# EAGLE design Claw Machine Final (EAGLE 9.6.2)
AUTHOR: Yiu & Humpal; BOARD_NAME: Claw Machine; DOC_NUM: 0001; PROJECT_NAME: Chessbot; REVISION: 5
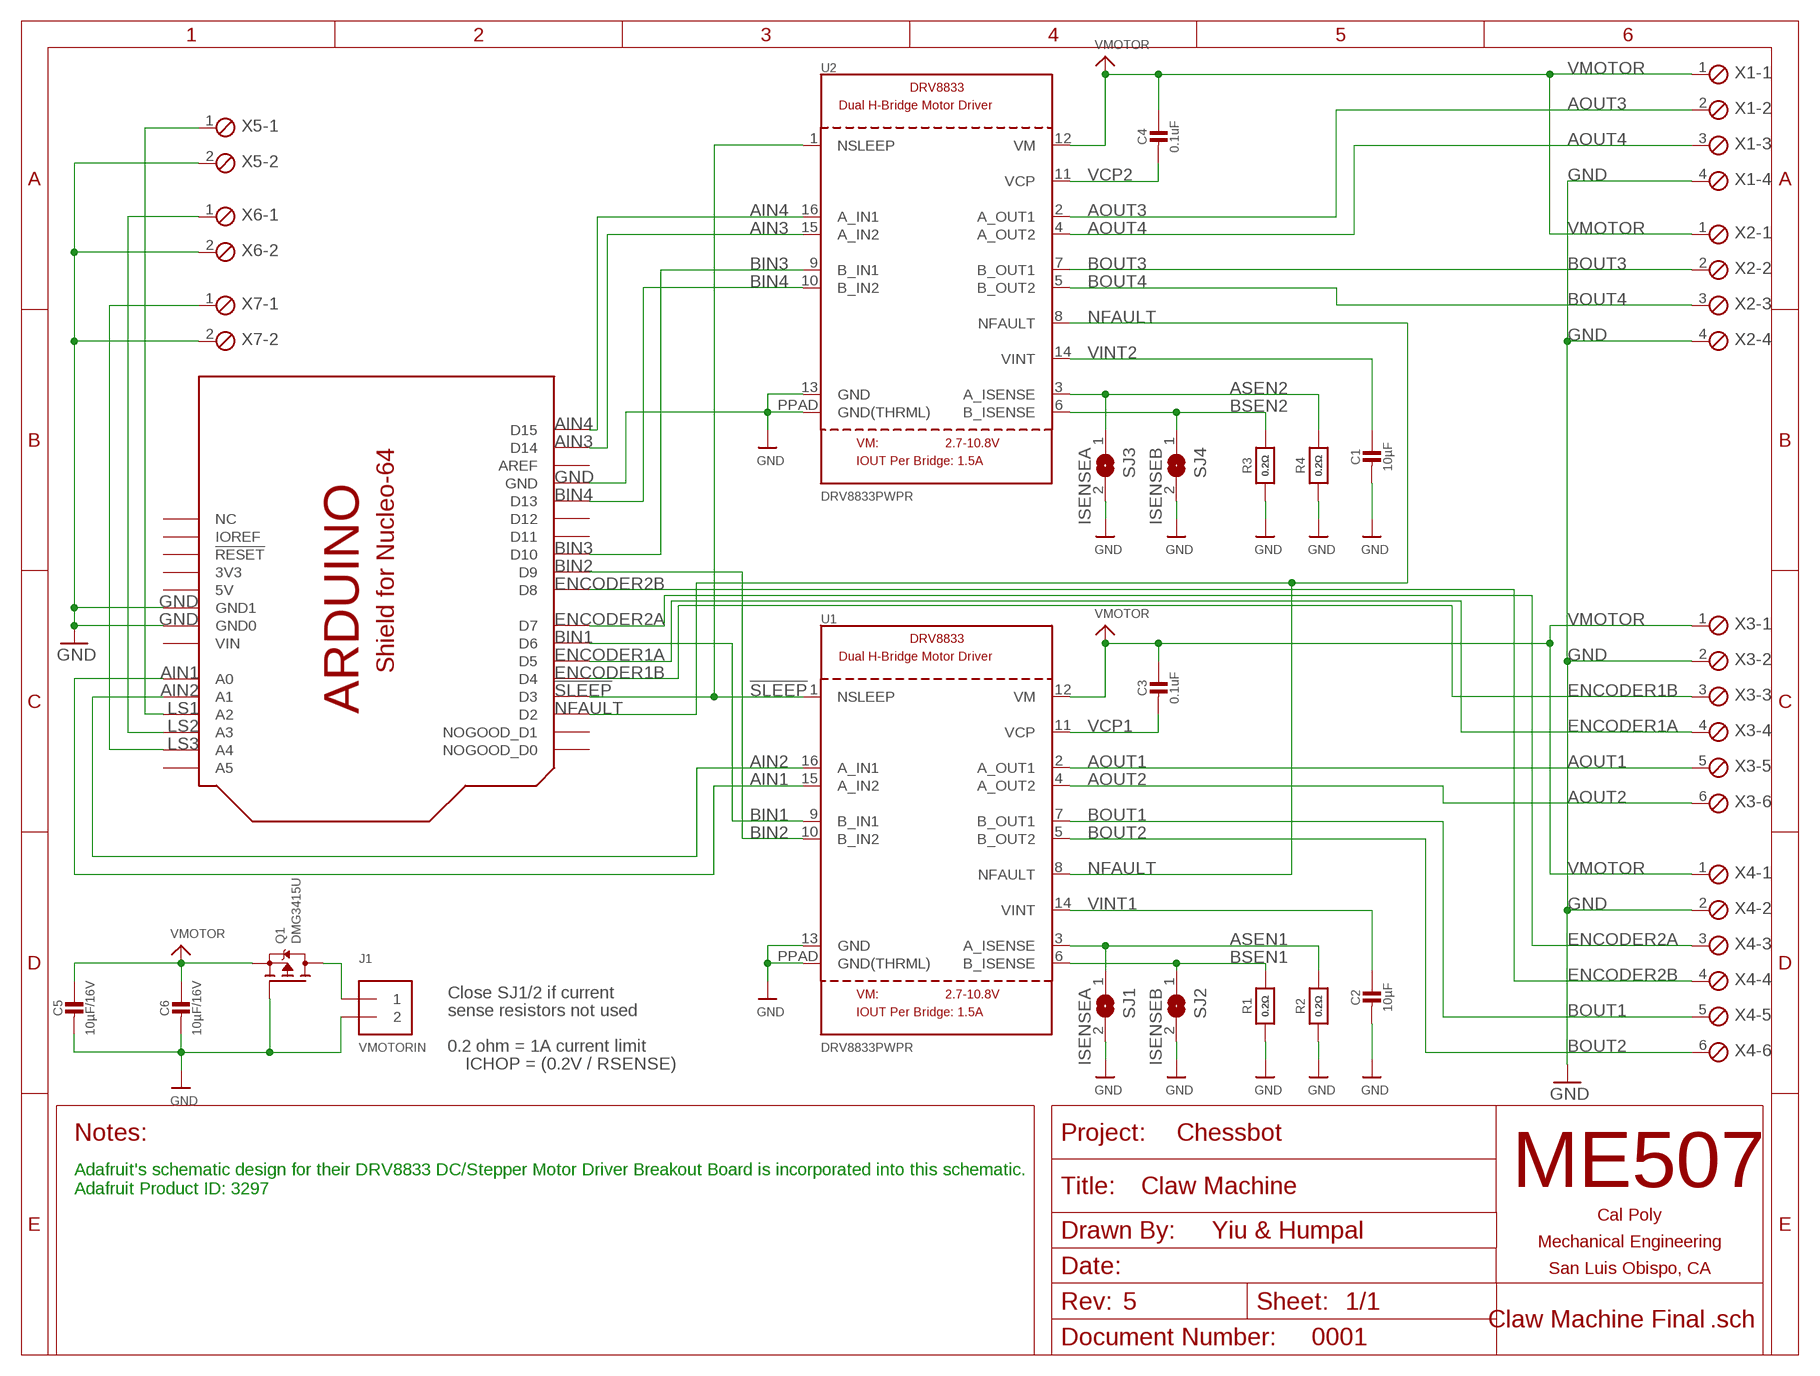
[diagram p0: schematic, sheet 1]

## Parts
C1  10µF  CAP_CERAMIC0805-NOOUTLINE  [0805-NO]
C2  10µF  CAP_CERAMIC0805-NOOUTLINE  [0805-NO]
C3  0.1uF  CAP_CERAMIC0805-NOOUTLINE  [0805-NO]
C4  0.1uF  CAP_CERAMIC0805-NOOUTLINE  [0805-NO]
C5  10µF/16V  CAP_CERAMIC0805-NOOUTLINE  [0805-NO]
C6  10µF/16V  CAP_CERAMIC0805-NOOUTLINE  [0805-NO]
J1  VMOTORIN  TERMBLOCK_1X2  [TERMBLOCK_1X2-3.5MM]
Q1  DMG3415U  MOSFET-PWIDE  [SOT23-WIDE]
R1  0.2Ω  RESISTOR_1206  [_1206]
R2  0.2Ω  RESISTOR_1206  [_1206]
R3  0.2Ω  RESISTOR_1206  [_1206]
R4  0.2Ω  RESISTOR_1206  [_1206]
SJ1  ISENSEA  SOLDERJUMPER  [SOLDERJUMPER_ARROW_NOPASTE]
SJ2  ISENSEB  SOLDERJUMPER  [SOLDERJUMPER_ARROW_NOPASTE]
SJ3  ISENSEA  SOLDERJUMPER  [SOLDERJUMPER_ARROW_NOPASTE]
SJ4  ISENSEB  SOLDERJUMPER  [SOLDERJUMPER_ARROW_NOPASTE]
U1  DRV8833PWPR  DRV8833  [HTSSOP16]
U2  DRV8833PWPR  DRV8833  [HTSSOP16]
U$1  SHIELD_FOR_NUCLE0_64_STANDARD  [SHIELD_FOR_NUCLEO_64_STD]
X1  SCREWTERM_4P_254  [4POL254]
X2  SCREWTERM_4P_254  [4POL254]
X3  SCREWTERM_6P_254  [6POL254]
X4  SCREWTERM_6P_254  [6POL254]
X5  SCREWTERM_2P_254  [2POL254]
X6  SCREWTERM_2P_254  [2POL254]
X7  SCREWTERM_2P_254  [2POL254]

## Nets
!SLEEP: U1.1(NSLEEP) U2.1(NSLEEP) U$1.D3
AIN1: U1.15(A_IN2) U$1.A0
AIN2: U1.16(A_IN1) U$1.A1
AIN3: U2.15(A_IN2) U$1.D14
AIN4: U2.16(A_IN1) U$1.D15
AOUT1: U1.2(A_OUT1) X3.5
AOUT2: U1.4(A_OUT2) X3.6
AOUT3: U2.2(A_OUT1) X1.2
AOUT4: U2.4(A_OUT2) X1.3
ASEN1: R2.2 SJ1.1 U1.3(A_ISENSE)
ASEN2: R4.2 SJ3.1 U2.3(A_ISENSE)
BIN1: U1.9(B_IN1) U$1.D6
BIN2: U1.10(B_IN2) U$1.D9
BIN3: U2.9(B_IN1) U$1.D10
BIN4: U2.10(B_IN2) U$1.D13
BOUT1: U1.7(B_OUT1) X4.5
BOUT2: U1.5(B_OUT2) X4.6
BOUT3: U2.7(B_OUT1) X2.2
BOUT4: U2.5(B_OUT2) X2.3
BSEN1: R1.2 SJ2.1 U1.6(B_ISENSE)
BSEN2: R3.2 SJ4.1 U2.6(B_ISENSE)
ENCODER1A: U$1.D5 X3.4
ENCODER1B: U$1.D4 X3.3
ENCODER2A: U$1.D7 X4.3
ENCODER2B: U$1.D8 X4.4
GND: C1.2 C2.2 C5.2 C6.2 J1.2 Q1.1(G) R1.1 R2.1 R3.1 R4.1 SJ1.2 SJ2.2 SJ3.2 SJ4.2 U1.13(GND) U1.PPAD(GND(THRML)) U2.13(GND) U2.PPAD(GND(THRML)) U$1.GND U$1.GND1(GND0) U$1.GND2(GND1) X1.4 X2.4 X3.2 X4.2 X5.2 X6.2 X7.2
LS1: U$1.A2 X5.1
LS2: U$1.A3 X6.1
LS3: U$1.A4 X7.1
NFAULT: U1.8(NFAULT) U2.8(NFAULT) U$1.D2
PWRIN: J1.1 Q1.3(D)
VCP1: C3.2 U1.11(VCP)
VCP2: C4.2 U2.11(VCP)
VINT1: C2.1 U1.14(VINT)
VINT2: C1.1 U2.14(VINT)
VMOTOR: C3.1 C4.1 C5.1 C6.1 Q1.2(S) U1.12(VM) U2.12(VM) X1.1 X2.1 X3.1 X4.1
Unconnected: U$1.A5 U$1.AREF U$1.D0(NOGOOD_D0) U$1.D1(NOGOOD_D1) U$1.D11 U$1.D12 U$1.IOREF U$1.NC U$1.NRST(!RESET)

## Notes on the sheet
- Close SJ1/2 if current
- sense resistors not used
- 0.2 ohm = 1A current limit
- ICHOP = (0.2V / RSENSE)
- Adafruit's schematic design for their DRV8833 DC/Stepper Motor Driver Breakout Board is incorporated into this schematic.
  Adafruit Product ID: 3297

## Power pins joined to a net without a drawn wire
3V3: U$1.3V(3V3)
5V: U$1.5V
VIN: U$1.VIN

## Library data of the parts
C1-C6 = microbuilder:CAP_CERAMIC: Ceramic Capacitors For new designs, use the packages preceded by an '_' character since they are more reliable: The following footprints should be used on most boards: _0402 - Standard footprint for regular board layouts _0603 - Standard footprint for regular board layouts _0805 - Standard footprint for regular board layouts _1206 - Standard footprint for regular board layouts For extremely tight-pitch boards where space is at a premium, the following 'micro-pitch' footprints can be used (smaller pads, no silkscreen outline, etc.): _0402MP - Micro-pitch footprint for very dense/compact boards _0603MP - Micro-pitch footprint for very dense/compact boards _0805MP - Micro-pitch footprint for very dense/compact boards _1206MP - Micro-pitch footprint for very dense/compact boards
J1 = microbuilder:TERMBLOCK_1X2: 3.5mm Terminal block http://www.ladyada.net/library/pcb/eaglelibrary.html
Q1 = microbuilder:MOSFET-P: P-Channel Mosfet LEGEND VDS: Voltage Drain-Source ID: Drain Current RDS(ON): Drain-Source On-State Resistance VGS(TH): Gate-Source Threshold Voltage CISS: Drain-Source Input Capacitance SOT-23 Name VDS ID RDS(ON) VGS(TH) CISS Order Number IRLML5103 30V 760mA 600 mOhm -- 75pF @ 25V Digikey: IRLML5103PBFCT-ND IRLML6401 12V 4.3A 50 mOhm 950mV @ 250µA 830pF @ 10V Digikey: IRLML6401PBFTR-ND NTR0202PL 20V 400mA 800 mOhm 2.3V @ 250uA 70pF @ 5V Digikey: NTR0202PLT1GOSTR-ND NTR4101PT1G 20V 1.8A 85 mOhm 1.2V @ 250uA 675pF @ 10V Digikey: NTR4101PT1GOSCT-ND DMP2004K 20V 600mA 900 mOhm 1V @ 250uA 175pF @ 16V Digikey: DMP2004KDICT-ND PMV65XP 20V 3.9A 76 mOhm 950mV @ 1mA 725pF @ 20V Digikey: 568-2358-2-ND TO-252 Name VDS ID RDS(ON) VGS(TH) CISS Order Number AOD417 30V 25A 34 mOhm 3V @ 250µA 920pF @ 15V Digikey: 785-1106-2-ND
R1-R4 = microbuilder:RESISTOR: Resistors For new designs, use the packages preceded by an '_' character since they are more reliable: The following footprints should be used on most boards: _0402 - Standard footprint for regular board layouts _0603 - Standard footprint for regular board layouts _0805 - Standard footprint for regular board layouts _1206 - Standard footprint for regular board layouts For extremely tight-pitch boards where space is at a premium, the following 'micro-pitch' footprints can be used (smaller pads, no silkscreen outline, etc.): _0402MP - Micro-pitch footprint for very dense/compact boards _0603MP - Micro-pitch footprint for very dense/compact boards _0805MP - Micro-pitch footprint for very dense/compact boards _1206MP - Micro-pitch footprint for very dense/compact boards
SJ1-SJ4 = microbuilder:SOLDERJUMPER: SMD Solder JUMPER Solder the two pads together to create a connection, or remove the solder to break it. REFLOW - Use this footprint for solder paste and reflow ovens. WAVE - Use this footprint for hand-soldering (larger pads). CLOSED - Has a trace between the two pads to ensure it is closed by default. The trace needs to be cut to disable the jumper, and can be closed again by creating a solder bridge between the two pads.; BOM: EXCLUDE
U1 U2 = microbuilder:DRV8833: DRV8833 Dual H-Bridge Motor Driver -- HTSSOP Package
U$1 = ME507:SHIELD_FOR_NUCLE0_64: Arduino Style Shield for Nucleo-64 This is a board outline with pin locations for an Arduino style shield which fits on top of an STM32 Nucleo-64. Pin names are generic except for Nucleo specific pins such as IOREF. There are two board sizes, the standard which matches the size of an Arduino Uno, and the short version which can be less expensive to produce if you don't need a lot of board area. The outline is on the DIMENSION layer. When making a new board, you must delete the lines which form the default board outline so that this package's outlines control the dimensions of the board. Pins D0 and D1 are connected to a communications port and are not available for general use, so they are labeled as NOGOOD on the symbol and footprints.
X1 X2 = ME507:SCREWTERM_4P: Screw Terminal Block This part is designed for a screw terminal connector. The 2.54mm (0.100 inch) foorprint can also be used for male or female pin headers such as those on most development boards. One can also solder wires directly into the holes, though this makes modifications or repairs to the system more inconvenient. Larger versions can carry more current.
X3 X4 = ME507:SCREWTERM_6P: Screw Terminal Block This part is designed for a screw terminal connector. The 2.54mm (0.100 inch) foorprint can also be used for male or female pin headers such as those on most development boards. One can also solder wires directly into the holes, though this makes modifications or repairs to the system more inconvenient. Larger versions can carry more current.
X5-X7 = ME507:SCREWTERM_2P: Screw Terminal Block This part is designed for a screw terminal connector. The 2.54mm (0.100 inch) foorprint can also be used for male or female pin headers such as those on most development boards. One can also solder wires directly into the holes, though this makes modifications or repairs to the system more inconvenient. Larger versions can carry more current.

## Board
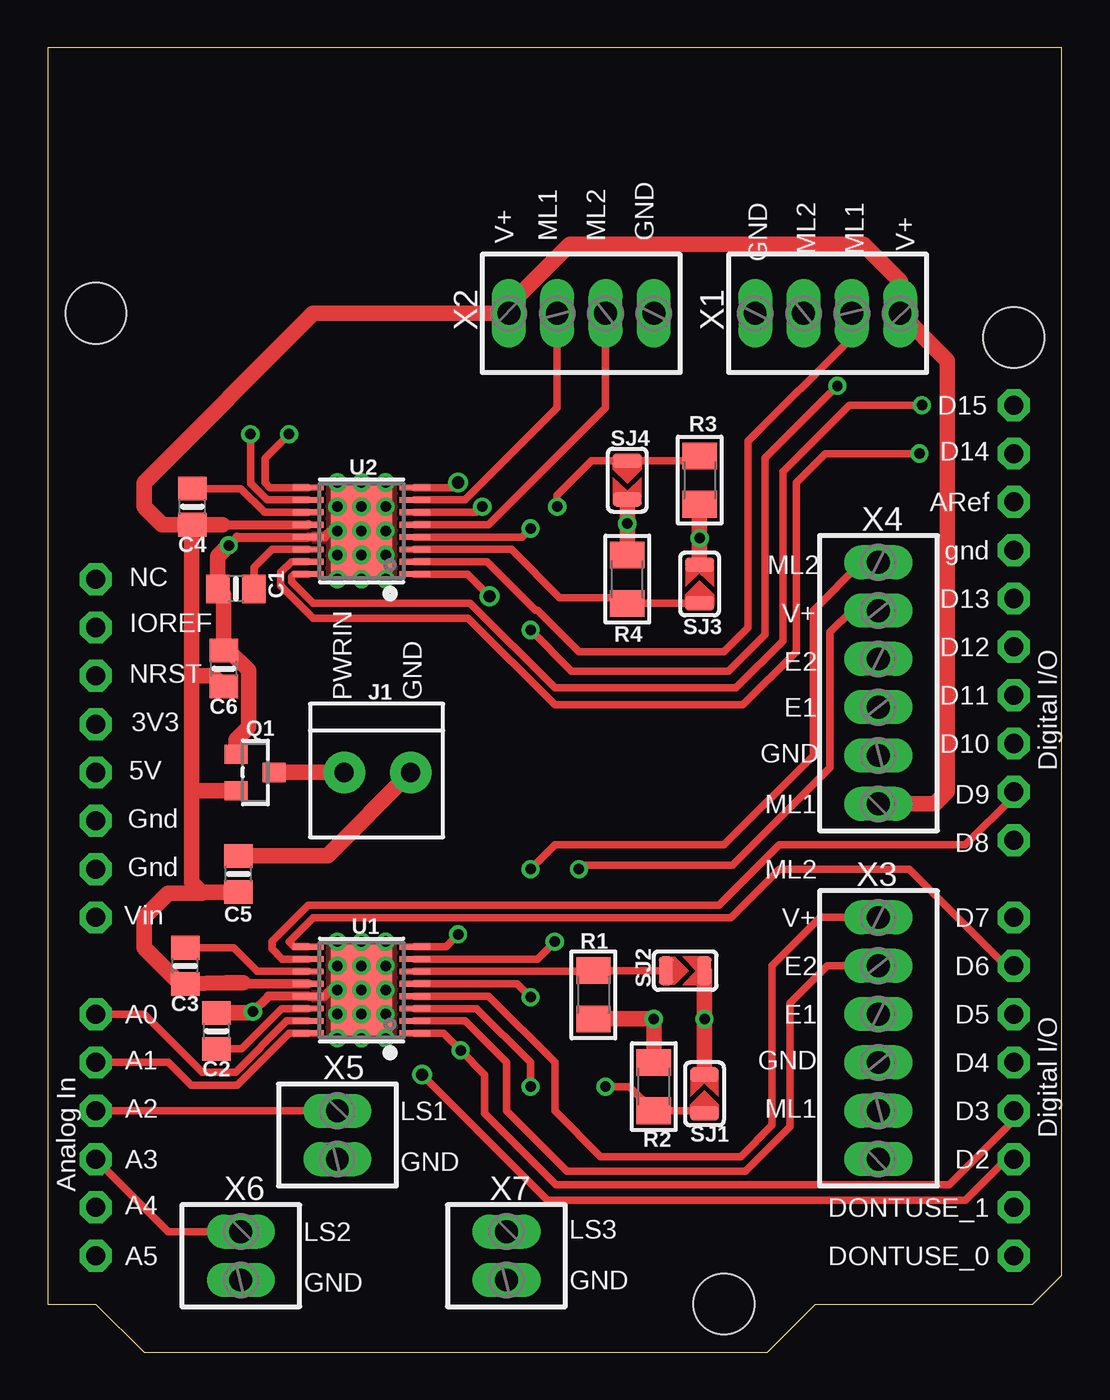
[diagram p1: board, top side]
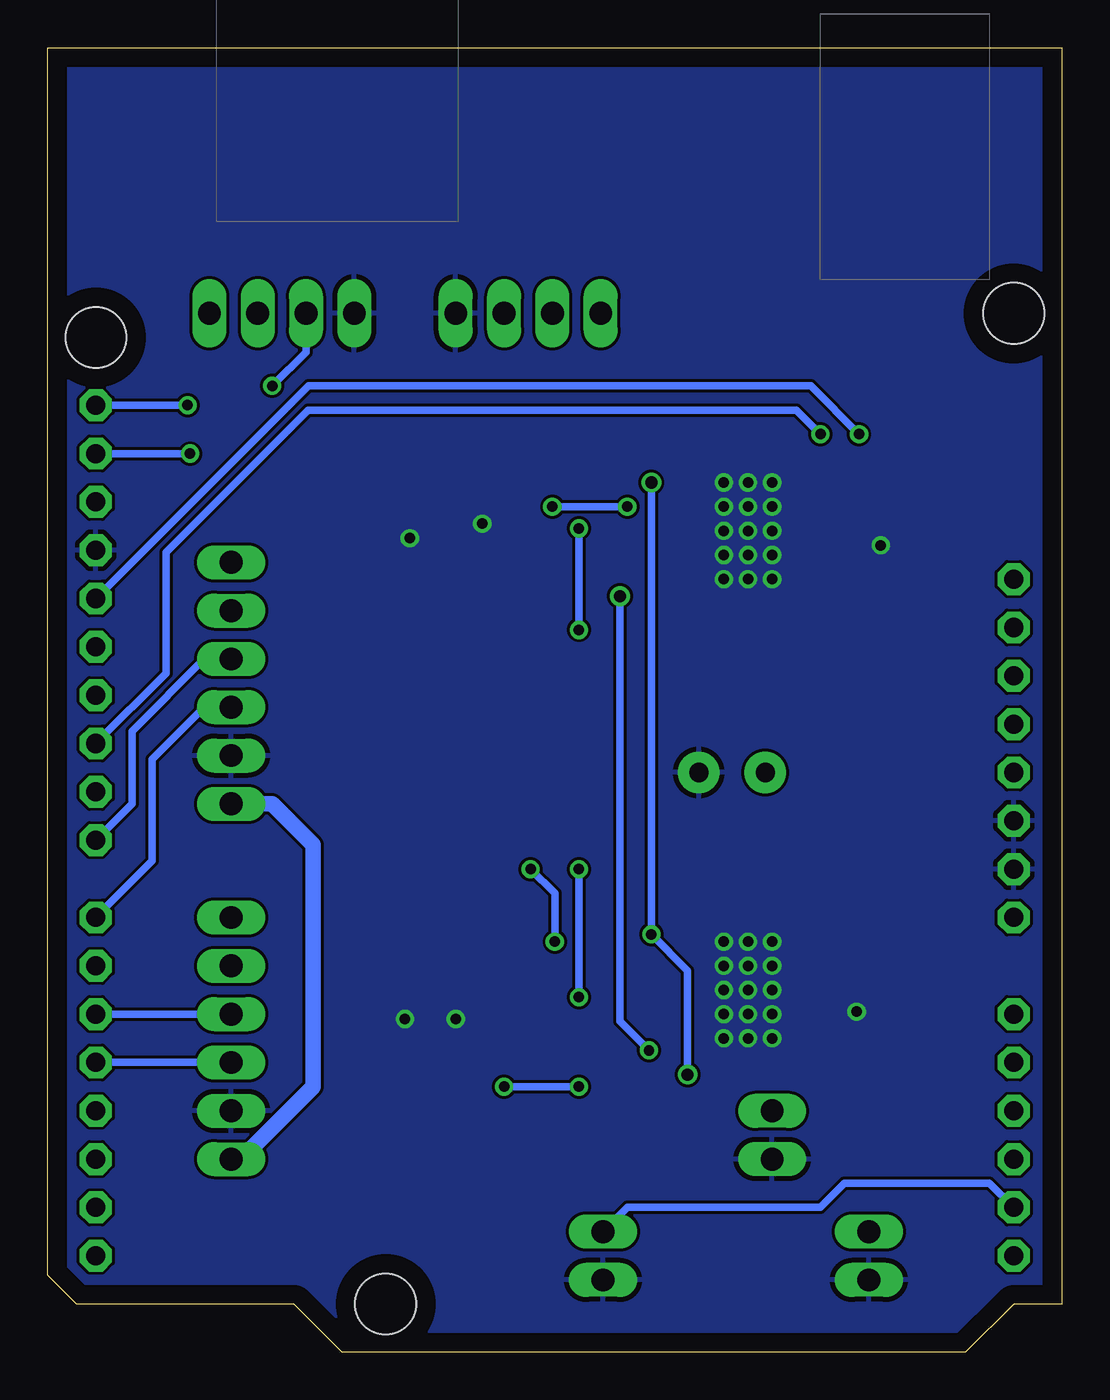
[diagram p2: board, bottom side, seen from below]

Size 53.34 x 68.58 mm. Coordinates in mm from the lower left corner, seen from the top.
Copper layers (1*16): Top 0.035mm / dielectric 1.5mm / Bottom 0.035mm
Design rules "default": minimum track width 6mil, minimum drill 0.35mm, track to track 6mil, track to pad 6mil, pad to pad 6mil, via to via 6mil, smd to smd 6mil, copper to edge 40mil, drill to drill 6mil, minimum pad ring 10mil, minimum via ring 8mil, stop-mask expansion 4mil, vias tented up to drill 0mil, thermal gap 10mil

### Footprints (pad centres in the part's own frame; a part is rotated, then mirrored left to right if it is on the bottom)
0805-NO = smd 1.24 x 1.5: 1 -0.95,0; 2 0.95,0
TERMBLOCK_1X2-3.5MM = drill 1 pad 2.184: 1 1.8,0; 2 -1.7,0
SOT23-WIDE = smd 1 x 1.2: 1 -0.95,-1; 2 0.95,-1; 3 0,1
_1206 = smd 1.4 x 1.8: 1 -1.27,0; 2 1.27,0
SOLDERJUMPER_ARROW_NOPASTE = smd 0.762 x 1.524: 1 -1.016,0; 2 1.016,0
HTSSOP16 = smd 0.3 x 1.6: 1 -2.275,-2.8; 2 -1.625,-2.8; 3 -0.975,-2.8; 4 -0.325,-2.8; 5 0.325,-2.8; 6 0.975,-2.8; 7 1.625,-2.8; 8 2.275,-2.8; 9 2.275,2.8; 10 1.625,2.8; 11 0.975,2.8; 12 0.325,2.8; 13 -0.325,2.8; 14 -0.975,2.8; 15 -1.625,2.8; 16 -2.275,2.8 | smd 4.8 x 3.2: PPAD 0,0
SHIELD_FOR_NUCLEO_64_STD = drill 1 pad 1.676 octagon: 3V 35.56,2.54; 5V 38.1,2.54; A0 50.8,2.54; A1 53.34,2.54; A2 55.88,2.54; A3 58.42,2.54; A4 60.96,2.54; A5 63.5,2.54; AREF 23.876,50.8; D0 63.5,50.8; D1 60.96,50.8; D2 58.42,50.8; D3 55.88,50.8; D4 53.34,50.8; D5 50.8,50.8; D6 48.26,50.8; D7 45.72,50.8; D8 41.656,50.8; D9 39.116,50.8; D10 36.576,50.8; D11 34.036,50.8; D12 31.496,50.8; D13 28.956,50.8; D14 21.336,50.8; D15 18.796,50.8; GND 26.416,50.8; GND1 43.18,2.54; GND2 40.64,2.54; IOREF 30.48,2.54; NC 27.94,2.54; NRST 33.02,2.54; VIN 45.72,2.54 | hole 3.2: 15.24,50.8; 66.04,35.56; 13.97,2.54
4POL254 = drill 1.2 long: 1 -3.81,0; 2 -1.27,0; 3 1.27,0; 4 3.81,0
6POL254 = drill 1.2 pad 1.778 long: 1 -6.35,0; 2 -3.81,0; 3 -1.27,0; 4 1.27,0; 5 3.81,0; 6 6.35,0
2POL254 = drill 1.2 long: 1 -1.27,0; 2 1.27,0

### Placement (x,y rotation side)
C1  9.91,40.13 180 top
C2  8.89,16.89 90 top
C3  7.24,20.32 90 top
C4  7.62,44.45 90 top
C5  10.03,25.15 90 top
C6  9.27,35.94 90 top
J1  17.4,30.48 180 top
Q1  10.92,30.48 270 top
R1  28.7,18.8 90 top
R2  31.88,13.97 270 top
R3  34.29,45.85 90 top
R4  30.48,40.64 270 top
SJ1  34.54,13.59 90 top
SJ2  33.53,20.07 0 top
SJ3  34.29,40.39 90 top
SJ4  30.48,45.85 270 top
U1  16.51,19.05 90 top
U2  16.51,43.18 90 top
U$1  0,68.58 270 top
X1  41.02,54.61 180 top
X2  28.07,54.61 0 top
X3  43.69,16.51 90 top
X4  43.69,35.18 90 top
X5  15.24,11.43 270 top
X6  10.16,5.08 270 top
X7  24.13,5.08 270 top

### Tracks (layer width: path | path; a pad name or v marks a point on that pad's centre or on a via)
!SLEEP  (via drill 0.55, 0.64)
  Top 0.406: v23.24,39.75 22.09,40.9 U2.1 | U1.1 20.82,16.77 v21.72,15.87 22.99,14.6 22.99,12.57 26.75,8.81 47.42,8.81 50.8,12.19 U$1.D3
  Bottom 0.406: v23.24,39.75 23.24,17.4 v21.72,15.87
AIN1
  Top 0.406: U$1.A0 5.08,17.78 8.13,14.73 9.88,14.73 12.57,17.42 U1.15
AIN2
  Top 0.406: U1.16 12.71,16.77 9.98,14.05 7.54,14.05 6.35,15.24 U$1.A1
AIN3  (via drill 0.55)
  Top 0.406: v45.85,47.24 40.89,47.24 39.37,45.72 39.37,36.83 36.58,34.04 26.67,34.04 22.11,38.59 13.96,38.59 12.27,40.28 12.27,41 12.82,41.55 U2.15
  Bottom 0.406: U$1.D14 v45.85,47.24
AIN4  (via drill 0.55)
  Top 0.406: U2.16 12.96,40.9 12.83,40.77 12.83,40.51 13.97,39.37 22.22,39.37 26.67,34.92 36.2,34.92 38.66,37.39 38.66,46.28 42.16,49.78 v45.97,49.78
  Bottom 0.406: U$1.D15 v45.97,49.78
AOUT1
  Top 0.406: U1.2 21.95,17.42 24.13,15.24 24.13,12.7 27.3,9.52 36.7,9.52 39.04,11.86 39.04,18.35 41.01,20.32 X3.5
AOUT2
  Top 0.406: U1.4 23.19,18.72 26.67,15.24 26.67,12.7 29.08,10.29 36.45,10.29 38.1,11.94 38.1,20.32 40.64,22.86 X3.6
AOUT3
  Top 0.406: U2.2 23.12,41.55 25.66,39.01 25.76,39.01 27.94,36.83 35.56,36.83 36.83,38.1 36.83,47.88 42.29,53.34 X1.2
AOUT4  (via drill 0.55)
  Top 0.406: U2.4 24.95,42.85 v25.4,43.31 | v25.4,37.97 27.56,35.81 35.81,35.81 37.72,37.72 37.72,46.99 v41.53,50.8
  Bottom 0.406: v25.4,43.31 v25.4,37.97 | v41.53,50.8 39.75,52.58 X1.3
ASEN1  (via drill 0.55)
  Top 0.406: U1.3 22.56,18.07 25.4,15.24 v25.4,13.97 | v29.34,13.97 30.61,13.97 R2.2 34.42,12.7 SJ1.1
  Bottom 0.406: v25.4,13.97 v29.34,13.97
ASEN2
  Top 0.406: U2.3 24.39,42.2 26.93,39.66 30.19,39.66 R4.2 SJ3.1
BIN1
  Top 0.406: U1.9 12.96,21.32 12.7,21.59 13.96,22.85 35.94,22.85 38.48,25.4 45.3,25.4 50.38,20.32 U$1.D6
BIN2
  Top 0.406: U1.10 12.34,20.67 11.81,21.21 11.81,21.62 13.69,23.49 35.31,23.49 38.48,26.67 48.26,26.67 50.8,29.21 U$1.D9
BIN3  (via drill 0.55)
  Top 0.406: U2.9 11.69,45.45 11.43,45.71 11.43,46.99 v12.7,48.26
  Bottom 0.406: U$1.D10 47.11,35.69 47.11,42.05 39.63,49.53 13.97,49.53 v12.7,48.26
BIN4  (via drill 0.55)
  Top 0.406: U2.10 11.54,44.8 10.67,45.68 v10.67,48.26
  Bottom 0.406: U$1.D13 39.62,50.8 13.21,50.8 v10.67,48.26
BOUT1  (via drill 0.55)
  Top 0.406: U1.7 25.76,20.67 v26.67,21.59 | X4.5 42.28,38.99 41.15,37.85 41.15,30.73 36.01,25.6 28.14,25.6 v27.94,25.4
  Bottom 0.406: v27.94,25.4 26.67,24.13 v26.67,21.59
BOUT2  (via drill 0.55)
  Top 0.406: U1.5 24.69,19.37 v25.4,18.67 | X4.6 42.8,41.53 40.26,38.99 40.26,31.37 35.56,26.67 26.67,26.67 v25.4,25.4
  Bottom 0.406: v25.4,25.4 v25.4,18.67
BOUT3
  Top 0.406: U2.7 21.95,44.8 26.8,49.66 X2.2
BOUT4
  Top 0.406: U2.5 23.19,43.5 29.34,49.66 X2.3
BSEN1
  Top 0.406: SJ2.1 R1.2 28.66,20.02 U1.6
BSEN2  (via drill 0.55)
  Top 0.406: U2.6 22.56,44.15 v22.86,44.45 | R3.2 34.04,46.86 SJ4.1 28.6,46.86 26.8,45.06 v26.8,44.45
  Bottom 0.406: v26.8,44.45 v22.86,44.45
ENCODER1A
  Bottom 0.406: X3.4 U$1.D5
ENCODER1B
  Bottom 0.406: X3.3 U$1.D4
ENCODER2A
  Bottom 0.406: X4.3 45.09,33.91 47.83,31.17 47.83,25.83 U$1.D7
ENCODER2B
  Bottom 0.406: U$1.D8 48.89,28.83 48.89,32.65 45.09,36.45 X4.4
GND  (via drill 0.55)
  Top 0.483: v9.52,42.42 9.96,42.85 U2.13 14.57,42.86 14.89,43.18 U2.PPAD | U1.PPAD 14.89,19.05 14.57,18.73 U1.13 11.61,18.72 10.73,17.84
  Top 0.813: R2.1 v31.88,17.53 R1.1 | SJ2.2 v34.54,17.53 SJ1.2 | SJ4.2 v30.48,43.56 R4.1 | SJ3.2 v34.29,42.8 R3.1 | v9.52,42.42 8.96,41.85 C1.2 9.27,39.82 C6.2 9.53,36.89 10.58,35.84 10.58,32.87 9.92,32.21 Q1.1 | J1.2 14.71,26.1 C5.2 | C2.2 10.73,17.84 v10.79,17.91
  other vias: 17.78,17.78 16.51,17.78 15.24,17.78 15.24,19.05 15.24,20.32 15.24,21.59 16.51,21.59 17.78,21.59 16.51,20.32 17.78,19.05 17.78,20.32 16.51,19.05 15.24,45.72 17.78,16.51 16.51,16.51 15.24,16.51 16.51,45.72 17.78,45.72 15.24,44.45 16.51,44.45 17.78,44.45 17.78,43.18 17.78,41.91 17.78,40.64 16.51,40.64 15.24,40.64 15.24,41.91 15.24,43.18 16.51,43.18 16.51,41.91
  pour Bottom: 0,68.58 53.34,68.58 53.34,-2.54 0,-2.54
  pour Top (no thermals): 13.97,21.59 19.05,21.59 19.05,16.51 13.97,16.51
  pour Top (no thermals): 13.97,45.72 13.97,40.64 19.05,40.64 19.05,45.72
LS1
  Top 0.406: X5.1 U$1.A2
LS2
  Top 0.406: X6.1 6.35,6.35 U$1.A3
LS3
  Bottom 0.406: U$1.A4 3.81,8.89 11.43,8.89 12.7,7.62 22.86,7.62 X7.1
NFAULT  (via drill 0.55, 0.64)
  Top 0.406: v19.68,14.6 26.29,8 48.26,8 50.42,10.16 U$1.D2 | v21.59,21.97 20.94,21.32 U1.8 | v21.59,45.72 21.32,45.45 U2.8
  Bottom 0.406: v21.59,45.72 v21.59,21.97 19.68,20.07 v19.68,14.6
PWRIN
  Top 0.813: J1.1 Q1.3
VCP1
  Top 0.406: U1.11 11.02,20.02 9.78,21.27 C3.2
VCP2
  Top 0.406: U2.11 11.41,44.15 10.16,45.4 C4.2
VINT1
  Top 0.406: U1.14 12.32,18.07 10.2,15.96 8.91,15.96 C2.1
VINT2
  Top 0.406: U2.14 11.8,42.2 10.86,41.26 C1.1
VMOTOR
  Top 0.483: 9.21,43.5 U2.12
  Top 0.508: U1.12 10.34,19.37 10.29,19.43
  Top 0.813: 10.29,19.43 9.4,19.43 C3.1 6.98,19.37 5.08,21.27 5.08,22.86 6.35,24.13 8.13,24.13 | 7.58,35.56 7.58,31.75 7.58,29.53 | 7.58,29.53 7.58,24.68 8.13,24.13 | C6.1 8.7,35.56 7.58,35.56 | 8.13,24.13 8.19,24.2 C5.1 | X4.1 46.65,28.83 47.32,29.49 47.32,52.12 X1.1 44.83,56.3 42.89,58.24 27.46,58.24 24.26,55.03 X2.1 13.97,54.61 5.08,45.72 5.08,44.45 6.03,43.5 C4.1 | C4.1 9.21,43.5 | C4.1 7.58,43.46 7.58,35.56 | Q1.2 7.58,29.53
  Bottom 0.813: X4.1 41.53,28.83 39.37,26.67 39.37,13.97 43.18,10.16 X3.1

### Text on the board
tNames: GND | ML2 | ML1 | V+ | V+ | ML1 | ML2 | GND | ML2 | V+ | E2 | PWRIN | GND | E1 | GND | ML1 | ML2 | V+ | E2 | E1 | GND | LS1 | ML1 | GND | LS3 | LS2 | GND | GND